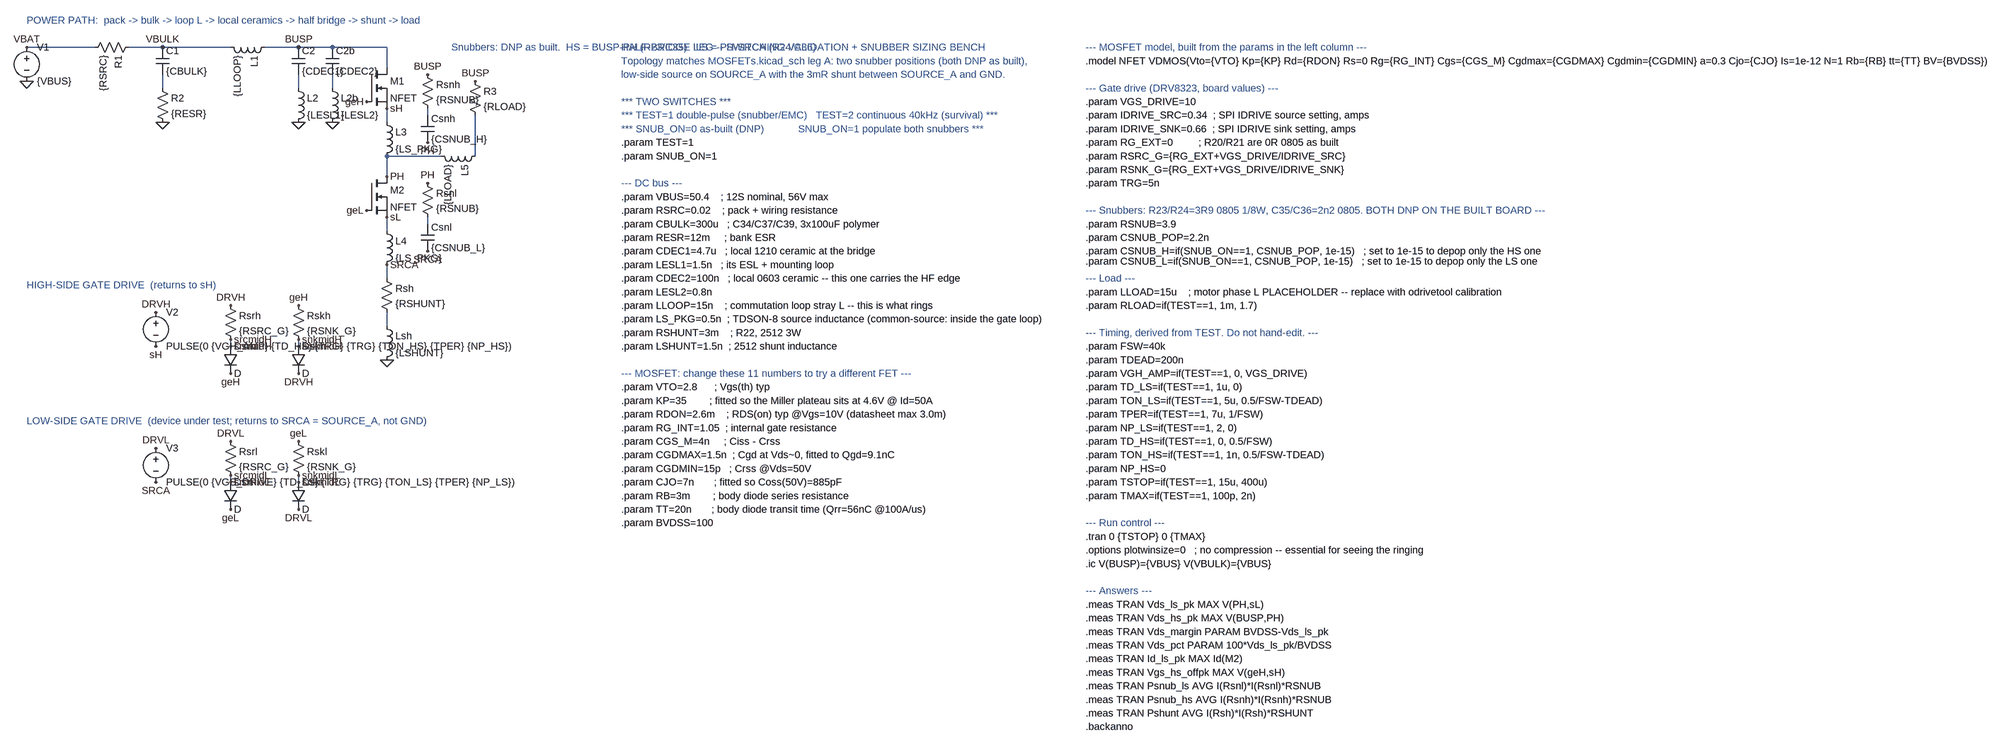
[diagram p0: schematic inverter_gate_motor_template.asc]
inverter_gate_motor_template.asc, the LTspice schematic file:
Version 4
SHEET 1 5044 1712
WIRE 160 96 0 96
WIRE 320 96 240 96
WIRE 480 96 320 96
WIRE 640 96 560 96
WIRE 720 96 640 96
WIRE 848 96 720 96
WIRE 848 144 848 96
WIRE 320 192 320 160
WIRE 640 192 640 160
WIRE 720 192 720 160
WIRE 944 256 944 240
WIRE 848 272 848 240
WIRE 976 352 848 352
WIRE 1056 352 1056 256
WIRE 848 400 848 352
WIRE 944 512 944 496
WIRE 848 528 848 496
WIRE 848 640 848 608
WIRE 848 752 848 720
WIRE 480 800 480 784
WIRE 640 800 640 784
WIRE 480 1120 480 1104
WIRE 640 1120 640 1104
FLAG 0 96 VBAT
FLAG 0 176 0
FLAG 320 96 VBULK
FLAG 320 272 0
FLAG 640 96 BUSP
FLAG 640 272 0
FLAG 720 272 0
FLAG 848 240 sH
FLAG 800 224 geH
FLAG 848 400 PH
FLAG 848 496 sL
FLAG 800 480 geL
FLAG 848 608 SRCA
FLAG 848 832 0
FLAG 944 160 BUSP
FLAG 944 320 PH
FLAG 944 416 PH
FLAG 944 576 SRCA
FLAG 1056 176 BUSP
FLAG 304 720 DRVH
FLAG 304 800 sH
FLAG 480 704 DRVH
FLAG 480 784 srcmidH
FLAG 480 800 srcmidH
FLAG 480 864 geH
FLAG 640 704 geH
FLAG 640 784 snkmidH
FLAG 640 800 snkmidH
FLAG 640 864 DRVH
FLAG 304 1040 DRVL
FLAG 304 1120 SRCA
FLAG 480 1024 DRVL
FLAG 480 1104 srcmidL
FLAG 480 1120 srcmidL
FLAG 480 1184 geL
FLAG 640 1024 geL
FLAG 640 1104 snkmidL
FLAG 640 1120 snkmidL
FLAG 640 1184 DRVL
SYMBOL voltage 0 80 R0
SYMATTR InstName V1
SYMATTR Value {VBUS}
SYMBOL res 256 80 R90
SYMATTR InstName R1
SYMATTR Value {RSRC}
SYMBOL cap 304 96 R0
SYMATTR InstName C1
SYMATTR Value {CBULK}
SYMBOL res 304 176 R0
SYMATTR InstName R2
SYMATTR Value {RESR}
SYMBOL ind 576 80 R90
SYMATTR InstName L1
SYMATTR Value {LLOOP}
SYMBOL cap 624 96 R0
SYMATTR InstName C2
SYMATTR Value {CDEC1}
SYMBOL ind 624 176 R0
SYMATTR InstName L2
SYMATTR Value {LESL1}
SYMBOL cap 704 96 R0
SYMATTR InstName C2b
SYMATTR Value {CDEC2}
SYMBOL ind 704 176 R0
SYMATTR InstName L2b
SYMATTR Value {LESL2}
SYMBOL nmos 800 144 R0
SYMATTR InstName M1
SYMATTR Value NFET
SYMBOL ind 832 256 R0
SYMATTR InstName L3
SYMATTR Value {LS_PKG}
SYMBOL nmos 800 400 R0
SYMATTR InstName M2
SYMATTR Value NFET
SYMBOL ind 832 512 R0
SYMATTR InstName L4
SYMATTR Value {LS_PKG}
SYMBOL res 832 624 R0
SYMATTR InstName Rsh
SYMATTR Value {RSHUNT}
SYMBOL ind 832 736 R0
SYMATTR InstName Lsh
SYMATTR Value {LSHUNT}
SYMBOL res 928 144 R0
SYMATTR InstName Rsnh
SYMATTR Value {RSNUB}
SYMBOL cap 928 256 R0
SYMATTR InstName Csnh
SYMATTR Value {CSNUB_H}
SYMBOL res 928 400 R0
SYMATTR InstName Rsnl
SYMATTR Value {RSNUB}
SYMBOL cap 928 512 R0
SYMATTR InstName Csnl
SYMATTR Value {CSNUB_L}
SYMBOL ind 1072 336 R90
SYMATTR InstName L5
SYMATTR Value {LLOAD}
SYMBOL res 1040 160 R0
SYMATTR InstName R3
SYMATTR Value {RLOAD}
SYMBOL voltage 304 704 R0
SYMATTR InstName V2
SYMATTR Value PULSE(0 {VGH_AMP} {TD_HS} {TRG} {TRG} {TON_HS} {TPER} {NP_HS})
SYMBOL res 464 688 R0
SYMATTR InstName Rsrh
SYMATTR Value {RSRC_G}
SYMBOL diode 464 800 R0
SYMATTR InstName Dsrh
SYMBOL res 624 688 R0
SYMATTR InstName Rskh
SYMATTR Value {RSNK_G}
SYMBOL diode 624 800 R0
SYMATTR InstName Dskh
SYMBOL voltage 304 1024 R0
SYMATTR InstName V3
SYMATTR Value PULSE(0 {VGS_DRIVE} {TD_LS} {TRG} {TRG} {TON_LS} {TPER} {NP_LS})
SYMBOL res 464 1008 R0
SYMATTR InstName Rsrl
SYMATTR Value {RSRC_G}
SYMBOL diode 464 1120 R0
SYMATTR InstName Dsrl
SYMBOL res 624 1008 R0
SYMATTR InstName Rskl
SYMATTR Value {RSNK_G}
SYMBOL diode 624 1120 R0
SYMATTR InstName Dskl
TEXT 0 32 Left 2 ;POWER PATH:  pack -> bulk -> loop L -> local ceramics -> half bridge -> shunt -> load
TEXT 0 656 Left 2 ;HIGH-SIDE GATE DRIVE  (returns to sH)
TEXT 0 976 Left 2 ;LOW-SIDE GATE DRIVE  (device under test; returns to SRCA = SOURCE_A, not GND)
TEXT 1000 96 Left 2 ;Snubbers: DNP as built.  HS = BUSP-PH (R23/C35)   LS = PH-SRCA (R24/C36)
TEXT 1400 96 Left 2 ;HALF-BRIDGE LEG -- SWITCHING VALIDATION + SNUBBER SIZING BENCH
TEXT 1400 128 Left 2 ;Topology matches MOSFETs.kicad_sch leg A: two snubber positions (both DNP as built),
TEXT 1400 160 Left 2 ;low-side source on SOURCE_A with the 3mR shunt between SOURCE_A and GND.
TEXT 1400 224 Left 2 ;*** TWO SWITCHES ***
TEXT 1400 256 Left 2 ;*** TEST=1 double-pulse (snubber/EMC)   TEST=2 continuous 40kHz (survival) ***
TEXT 1400 288 Left 2 ;*** SNUB_ON=0 as-built (DNP)            SNUB_ON=1 populate both snubbers ***
TEXT 1400 320 Left 2 !.param TEST=1
TEXT 1400 352 Left 2 !.param SNUB_ON=1
TEXT 1400 416 Left 2 ;--- DC bus ---
TEXT 1400 448 Left 2 !.param VBUS=50.4    ; 12S nominal, 56V max
TEXT 1400 480 Left 2 !.param RSRC=0.02    ; pack + wiring resistance
TEXT 1400 512 Left 2 !.param CBULK=300u   ; C34/C37/C39, 3x100uF polymer
TEXT 1400 544 Left 2 !.param RESR=12m     ; bank ESR
TEXT 1400 576 Left 2 !.param CDEC1=4.7u   ; local 1210 ceramic at the bridge
TEXT 1400 608 Left 2 !.param LESL1=1.5n   ; its ESL + mounting loop
TEXT 1400 640 Left 2 !.param CDEC2=100n   ; local 0603 ceramic -- this one carries the HF edge
TEXT 1400 672 Left 2 !.param LESL2=0.8n
TEXT 1400 704 Left 2 !.param LLOOP=15n    ; commutation loop stray L -- this is what rings
TEXT 1400 736 Left 2 !.param LS_PKG=0.5n  ; TDSON-8 source inductance (common-source: inside the gate loop)
TEXT 1400 768 Left 2 !.param RSHUNT=3m    ; R22, 2512 3W
TEXT 1400 800 Left 2 !.param LSHUNT=1.5n  ; 2512 shunt inductance
TEXT 1400 864 Left 2 ;--- MOSFET: change these 11 numbers to try a different FET ---
TEXT 1400 896 Left 2 !.param VTO=2.8      ; Vgs(th) typ
TEXT 1400 928 Left 2 !.param KP=35        ; fitted so the Miller plateau sits at 4.6V @ Id=50A
TEXT 1400 960 Left 2 !.param RDON=2.6m    ; RDS(on) typ @Vgs=10V (datasheet max 3.0m)
TEXT 1400 992 Left 2 !.param RG_INT=1.05  ; internal gate resistance
TEXT 1400 1024 Left 2 !.param CGS_M=4n     ; Ciss - Crss
TEXT 1400 1056 Left 2 !.param CGDMAX=1.5n  ; Cgd at Vds~0, fitted to Qgd=9.1nC
TEXT 1400 1088 Left 2 !.param CGDMIN=15p   ; Crss @Vds=50V
TEXT 1400 1120 Left 2 !.param CJO=7n       ; fitted so Coss(50V)=885pF
TEXT 1400 1152 Left 2 !.param RB=3m        ; body diode series resistance
TEXT 1400 1184 Left 2 !.param TT=20n       ; body diode transit time (Qrr=56nC @100A/us)
TEXT 1400 1216 Left 2 !.param BVDSS=100
TEXT 3000 96 Left 2 ;--- MOSFET model, built from the params in the left column ---
TEXT 3000 128 Left 2 !.model NFET VDMOS(Vto={VTO} Kp={KP} Rd={RDON} Rs=0 Rg={RG_INT} Cgs={CGS_M} Cgdmax={CGDMAX} Cgdmin={CGDMIN} a=0.3 Cjo={CJO} Is=1e-12 N=1 Rb={RB} tt={TT} BV={BVDSS})
TEXT 3000 192 Left 2 ;--- Gate drive (DRV8323, board values) ---
TEXT 3000 224 Left 2 !.param VGS_DRIVE=10
TEXT 3000 256 Left 2 !.param IDRIVE_SRC=0.34  ; SPI IDRIVE source setting, amps
TEXT 3000 288 Left 2 !.param IDRIVE_SNK=0.66  ; SPI IDRIVE sink setting, amps
TEXT 3000 320 Left 2 !.param RG_EXT=0         ; R20/R21 are 0R 0805 as built
TEXT 3000 352 Left 2 !.param RSRC_G={RG_EXT+VGS_DRIVE/IDRIVE_SRC}
TEXT 3000 384 Left 2 !.param RSNK_G={RG_EXT+VGS_DRIVE/IDRIVE_SNK}
TEXT 3000 416 Left 2 !.param TRG=5n
TEXT 3000 480 Left 2 ;--- Snubbers: R23/R24=3R9 0805 1/8W, C35/C36=2n2 0805. BOTH DNP ON THE BUILT BOARD ---
TEXT 3000 512 Left 2 !.param RSNUB=3.9
TEXT 3000 544 Left 2 !.param CSNUB_POP=2.2n
TEXT 3000 640 Left 2 ;--- Load ---
TEXT 3000 672 Left 2 !.param LLOAD=15u    ; motor phase L PLACEHOLDER -- replace with odrivetool calibration
TEXT 3000 704 Left 2 !.param RLOAD=if(TEST==1, 1m, 1.7)
TEXT 3000 768 Left 2 ;--- Timing, derived from TEST. Do not hand-edit. ---
TEXT 3000 800 Left 2 !.param FSW=40k
TEXT 3000 832 Left 2 !.param TDEAD=200n
TEXT 3000 864 Left 2 !.param VGH_AMP=if(TEST==1, 0, VGS_DRIVE)
TEXT 3000 896 Left 2 !.param TD_LS=if(TEST==1, 1u, 0)
TEXT 3000 928 Left 2 !.param TON_LS=if(TEST==1, 5u, 0.5/FSW-TDEAD)
TEXT 3000 960 Left 2 !.param TPER=if(TEST==1, 7u, 1/FSW)
TEXT 3000 992 Left 2 !.param NP_LS=if(TEST==1, 2, 0)
TEXT 3000 1024 Left 2 !.param TD_HS=if(TEST==1, 0, 0.5/FSW)
TEXT 3000 1056 Left 2 !.param TON_HS=if(TEST==1, 1n, 0.5/FSW-TDEAD)
TEXT 3000 1088 Left 2 !.param NP_HS=0
TEXT 3000 1120 Left 2 !.param TSTOP=if(TEST==1, 15u, 400u)
TEXT 3000 1152 Left 2 !.param TMAX=if(TEST==1, 100p, 2n)
TEXT 3000 1216 Left 2 ;--- Run control ---
TEXT 3000 1248 Left 2 !.tran 0 {TSTOP} 0 {TMAX}
TEXT 3000 1280 Left 2 !.options plotwinsize=0   ; no compression -- essential for seeing the ringing
TEXT 3000 1312 Left 2 !.ic V(BUSP)={VBUS} V(VBULK)={VBUS}
TEXT 3000 1376 Left 2 ;--- Answers ---
TEXT 3000 1408 Left 2 !.meas TRAN Vds_ls_pk MAX V(PH,sL)
TEXT 3000 1440 Left 2 !.meas TRAN Vds_hs_pk MAX V(BUSP,PH)
TEXT 3000 1472 Left 2 !.meas TRAN Vds_margin PARAM BVDSS-Vds_ls_pk
TEXT 3000 1504 Left 2 !.meas TRAN Vds_pct PARAM 100*Vds_ls_pk/BVDSS
TEXT 3000 1536 Left 2 !.meas TRAN Id_ls_pk MAX Id(M2)
TEXT 3000 1568 Left 2 !.meas TRAN Vgs_hs_offpk MAX V(geH,sH)
TEXT 3000 1600 Left 2 !.meas TRAN Psnub_ls AVG I(Rsnl)*I(Rsnl)*RSNUB
TEXT 3000 1632 Left 2 !.meas TRAN Psnub_hs AVG I(Rsnh)*I(Rsnh)*RSNUB
TEXT 3000 1664 Left 2 !.meas TRAN Pshunt AVG I(Rsh)*I(Rsh)*RSHUNT
TEXT 3000 1696 Left 2 !.backanno
TEXT 3000 576 Left 2 !.param CSNUB_H=if(SNUB_ON==1, CSNUB_POP, 1e-15)   ; set to 1e-15 to depop only the HS one
TEXT 3000 600 Left 2 !.param CSNUB_L=if(SNUB_ON==1, CSNUB_POP, 1e-15)   ; set to 1e-15 to depop only the LS one

The netlist it stands for:
* inverter_gate_motor_template.asc
V1 VBAT 0 {VBUS}
R1 VBULK VBAT {RSRC}
C1 VBULK N001 {CBULK}
R2 N001 0 {RESR}
L1 BUSP VBULK {LLOOP}
C2 BUSP N002 {CDEC1}
L2 N002 0 {LESL1}
C2b BUSP N003 {CDEC2}
L2b N003 0 {LESL2}
M1 BUSP geH sH sH NFET
L3 sH PH {LS_PKG}
M2 PH geL sL sL NFET
L4 sL SRCA {LS_PKG}
Rsh SRCA N007 {RSHUNT}
Lsh N007 0 {LSHUNT}
Rsnh BUSP N004 {RSNUB}
Csnh N004 PH {CSNUB_H}
Rsnl PH N006 {RSNUB}
Csnl N006 SRCA {CSNUB_L}
L5 N005 PH {LLOAD}
R3 BUSP N005 {RLOAD}
V2 DRVH sH PULSE(0 {VGH_AMP} {TD_HS} {TRG} {TRG} {TON_HS} {TPER} {NP_HS})
Rsrh DRVH srcmidH {RSRC_G}
Dsrh srcmidH geH D
Rskh geH snkmidH {RSNK_G}
Dskh snkmidH DRVH D
V3 DRVL SRCA PULSE(0 {VGS_DRIVE} {TD_LS} {TRG} {TRG} {TON_LS} {TPER} {NP_LS})
Rsrl DRVL srcmidL {RSRC_G}
Dsrl srcmidL geL D
Rskl geL snkmidL {RSNK_G}
Dskl snkmidL DRVL D
.model D D
.lib standard.dio
.model NMOS NMOS
.model PMOS PMOS
.lib standard.mos
* POWER PATH:  pack -> bulk -> loop L -> local ceramics -> half bridge -> shunt -> load
* HIGH-SIDE GATE DRIVE  (returns to sH)
* LOW-SIDE GATE DRIVE  (device under test; returns to SRCA = SOURCE_A, not GND)
* Snubbers: DNP as built.  HS = BUSP-PH (R23/C35)   LS = PH-SRCA (R24/C36)
* HALF-BRIDGE LEG -- SWITCHING VALIDATION + SNUBBER SIZING BENCH
* Topology matches MOSFETs.kicad_sch leg A: two snubber positions (both DNP as built),
* low-side source on SOURCE_A with the 3mR shunt between SOURCE_A and GND.
* *** TWO SWITCHES ***
* *** TEST=1 double-pulse (snubber/EMC)   TEST=2 continuous 40kHz (survival) ***
* *** SNUB_ON=0 as-built (DNP)            SNUB_ON=1 populate both snubbers ***
.param TEST=1
.param SNUB_ON=1
* --- DC bus ---
.param VBUS=50.4    ; 12S nominal, 56V max
.param RSRC=0.02    ; pack + wiring resistance
.param CBULK=300u   ; C34/C37/C39, 3x100uF polymer
.param RESR=12m     ; bank ESR
.param CDEC1=4.7u   ; local 1210 ceramic at the bridge
.param LESL1=1.5n   ; its ESL + mounting loop
.param CDEC2=100n   ; local 0603 ceramic -- this one carries the HF edge
.param LESL2=0.8n
.param LLOOP=15n    ; commutation loop stray L -- this is what rings
.param LS_PKG=0.5n  ; TDSON-8 source inductance (common-source: inside the gate loop)
.param RSHUNT=3m    ; R22, 2512 3W
.param LSHUNT=1.5n  ; 2512 shunt inductance
* --- MOSFET: change these 11 numbers to try a different FET ---
.param VTO=2.8      ; Vgs(th) typ
.param KP=35        ; fitted so the Miller plateau sits at 4.6V @ Id=50A
.param RDON=2.6m    ; RDS(on) typ @Vgs=10V (datasheet max 3.0m)
.param RG_INT=1.05  ; internal gate resistance
.param CGS_M=4n     ; Ciss - Crss
.param CGDMAX=1.5n  ; Cgd at Vds~0, fitted to Qgd=9.1nC
.param CGDMIN=15p   ; Crss @Vds=50V
.param CJO=7n       ; fitted so Coss(50V)=885pF
.param RB=3m        ; body diode series resistance
.param TT=20n       ; body diode transit time (Qrr=56nC @100A/us)
.param BVDSS=100
* --- MOSFET model, built from the params in the left column ---
.model NFET VDMOS(Vto={VTO} Kp={KP} Rd={RDON} Rs=0 Rg={RG_INT} Cgs={CGS_M} Cgdmax={CGDMAX} Cgdmin={CGDMIN} a=0.3 Cjo={CJO} Is=1e-12 N=1 Rb={RB} tt={TT} BV={BVDSS})
* --- Gate drive (DRV8323, board values) ---
.param VGS_DRIVE=10
.param IDRIVE_SRC=0.34  ; SPI IDRIVE source setting, amps
.param IDRIVE_SNK=0.66  ; SPI IDRIVE sink setting, amps
.param RG_EXT=0         ; R20/R21 are 0R 0805 as built
.param RSRC_G={RG_EXT+VGS_DRIVE/IDRIVE_SRC}
.param RSNK_G={RG_EXT+VGS_DRIVE/IDRIVE_SNK}
.param TRG=5n
* --- Snubbers: R23/R24=3R9 0805 1/8W, C35/C36=2n2 0805. BOTH DNP ON THE BUILT BOARD ---
.param RSNUB=3.9
.param CSNUB_POP=2.2n
* --- Load ---
.param LLOAD=15u    ; motor phase L PLACEHOLDER -- replace with odrivetool calibration
.param RLOAD=if(TEST==1, 1m, 1.7)
* --- Timing, derived from TEST. Do not hand-edit. ---
.param FSW=40k
.param TDEAD=200n
.param VGH_AMP=if(TEST==1, 0, VGS_DRIVE)
.param TD_LS=if(TEST==1, 1u, 0)
.param TON_LS=if(TEST==1, 5u, 0.5/FSW-TDEAD)
.param TPER=if(TEST==1, 7u, 1/FSW)
.param NP_LS=if(TEST==1, 2, 0)
.param TD_HS=if(TEST==1, 0, 0.5/FSW)
.param TON_HS=if(TEST==1, 1n, 0.5/FSW-TDEAD)
.param NP_HS=0
.param TSTOP=if(TEST==1, 15u, 400u)
.param TMAX=if(TEST==1, 100p, 2n)
* --- Run control ---
.tran 0 {TSTOP} 0 {TMAX}
.options plotwinsize=0   ; no compression -- essential for seeing the ringing
.ic V(BUSP)={VBUS} V(VBULK)={VBUS}
* --- Answers ---
.meas TRAN Vds_ls_pk MAX V(PH,sL)
.meas TRAN Vds_hs_pk MAX V(BUSP,PH)
.meas TRAN Vds_margin PARAM BVDSS-Vds_ls_pk
.meas TRAN Vds_pct PARAM 100*Vds_ls_pk/BVDSS
.meas TRAN Id_ls_pk MAX Id(M2)
.meas TRAN Vgs_hs_offpk MAX V(geH,sH)
.meas TRAN Psnub_ls AVG I(Rsnl)*I(Rsnl)*RSNUB
.meas TRAN Psnub_hs AVG I(Rsnh)*I(Rsnh)*RSNUB
.meas TRAN Pshunt AVG I(Rsh)*I(Rsh)*RSHUNT
.backanno
.param CSNUB_H=if(SNUB_ON==1, CSNUB_POP, 1e-15)   ; set to 1e-15 to depop only the HS one
.param CSNUB_L=if(SNUB_ON==1, CSNUB_POP, 1e-15)   ; set to 1e-15 to depop only the LS one
.backanno
.end